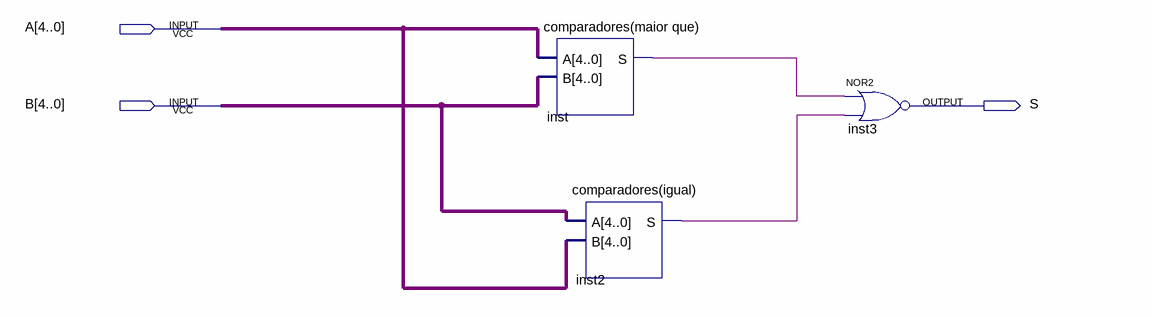
[diagram p0: schematic sheet]
// Quartus schematic comparadores(menor que).bdf as structural Verilog: 3 symbols, 3 pins
module \comparadores(menor_que)  (
  input  [4:0] A,
  input  [4:0] B,
  output S
);

  wire inst2_s, inst_s;

  \comparadores(maior_que)  inst (.A(A), .B(B), .S(inst_s));
  \comparadores(igual)  inst2 (.A(B), .B(A), .S(inst2_s));
  nor inst3 (S, inst_s, inst2_s);
endmodule
